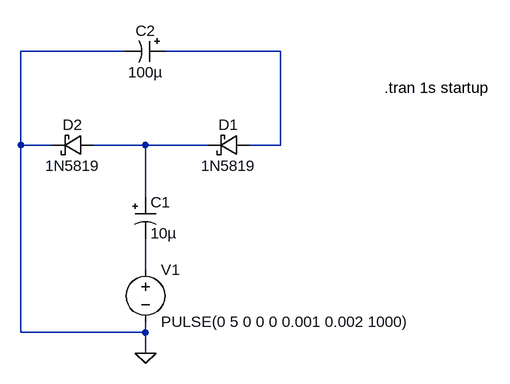
[diagram p0: schematic Draft1.asc]
Draft1.asc, the LTspice schematic file:
Version 4
SHEET 1 880 680
WIRE 240 176 80 176
WIRE 480 176 304 176
WIRE 80 320 80 176
WIRE 128 320 80 320
WIRE 272 320 192 320
WIRE 368 320 272 320
WIRE 480 320 480 176
WIRE 480 320 432 320
WIRE 272 400 272 320
WIRE 272 512 272 464
WIRE 80 608 80 320
WIRE 272 608 272 592
WIRE 272 608 80 608
WIRE 272 640 272 608
FLAG 272 640 0
SYMBOL schottky 432 304 R90
WINDOW 0 0 32 VBottom 2
WINDOW 3 32 32 VTop 2
SYMATTR InstName D1
SYMATTR Value 1N5819
SYMBOL schottky 192 304 R90
WINDOW 0 0 32 VBottom 2
WINDOW 3 32 32 VTop 2
SYMATTR InstName D2
SYMATTR Value 1N5819
SYMBOL polcap 256 400 R0
WINDOW 0 24 8 Left 2
WINDOW 3 24 56 Left 2
SYMATTR InstName C1
SYMATTR Value 10µ
SYMATTR Description Capacitor
SYMATTR Type cap
SYMATTR SpiceLine Rser=40m Lser=0 mfg="KEMET" pn="A700V106M12RATE040" type="Al electrolytic"
SYMBOL polcap 304 160 R90
WINDOW 0 0 32 VBottom 2
WINDOW 3 32 32 VTop 2
SYMATTR InstName C2
SYMATTR Value 100µ
SYMATTR Description Capacitor
SYMATTR Type cap
SYMATTR SpiceLine Rser=600m Lser=0 mfg="Nichicon" pn="UPG1E101MPH" type="Al electrolytic"
SYMBOL voltage 272 496 R0
SYMATTR InstName V1
SYMATTR Value PULSE(0 5 0 0 0 0.001 0.002 1000)
TEXT 640 232 Left 2 !.tran 1s startup

The netlist it stands for:
* Draft1.asc
D1 N001 N002 1N5819
D2 N002 0 1N5819
C1 N002 N003 10µ Rser=40m Lser=0 mfg="KEMET" pn="A700V106M12RATE040" type="Al electrolytic"
C2 N001 0 100µ Rser=600m Lser=0 mfg="Nichicon" pn="UPG1E101MPH" type="Al electrolytic"
V1 N003 0 PULSE(0 5 0 0 0 0.001 0.002 1000)
.model D D
.lib standard.dio
.tran 1s startup
.backanno
.end